# EAGLE schematic pcb_serial-adapter_serial-adapter (EAGLE 6.2)
DRAWING_NAME: CanSat 2012 Serial Adapter; REV: A
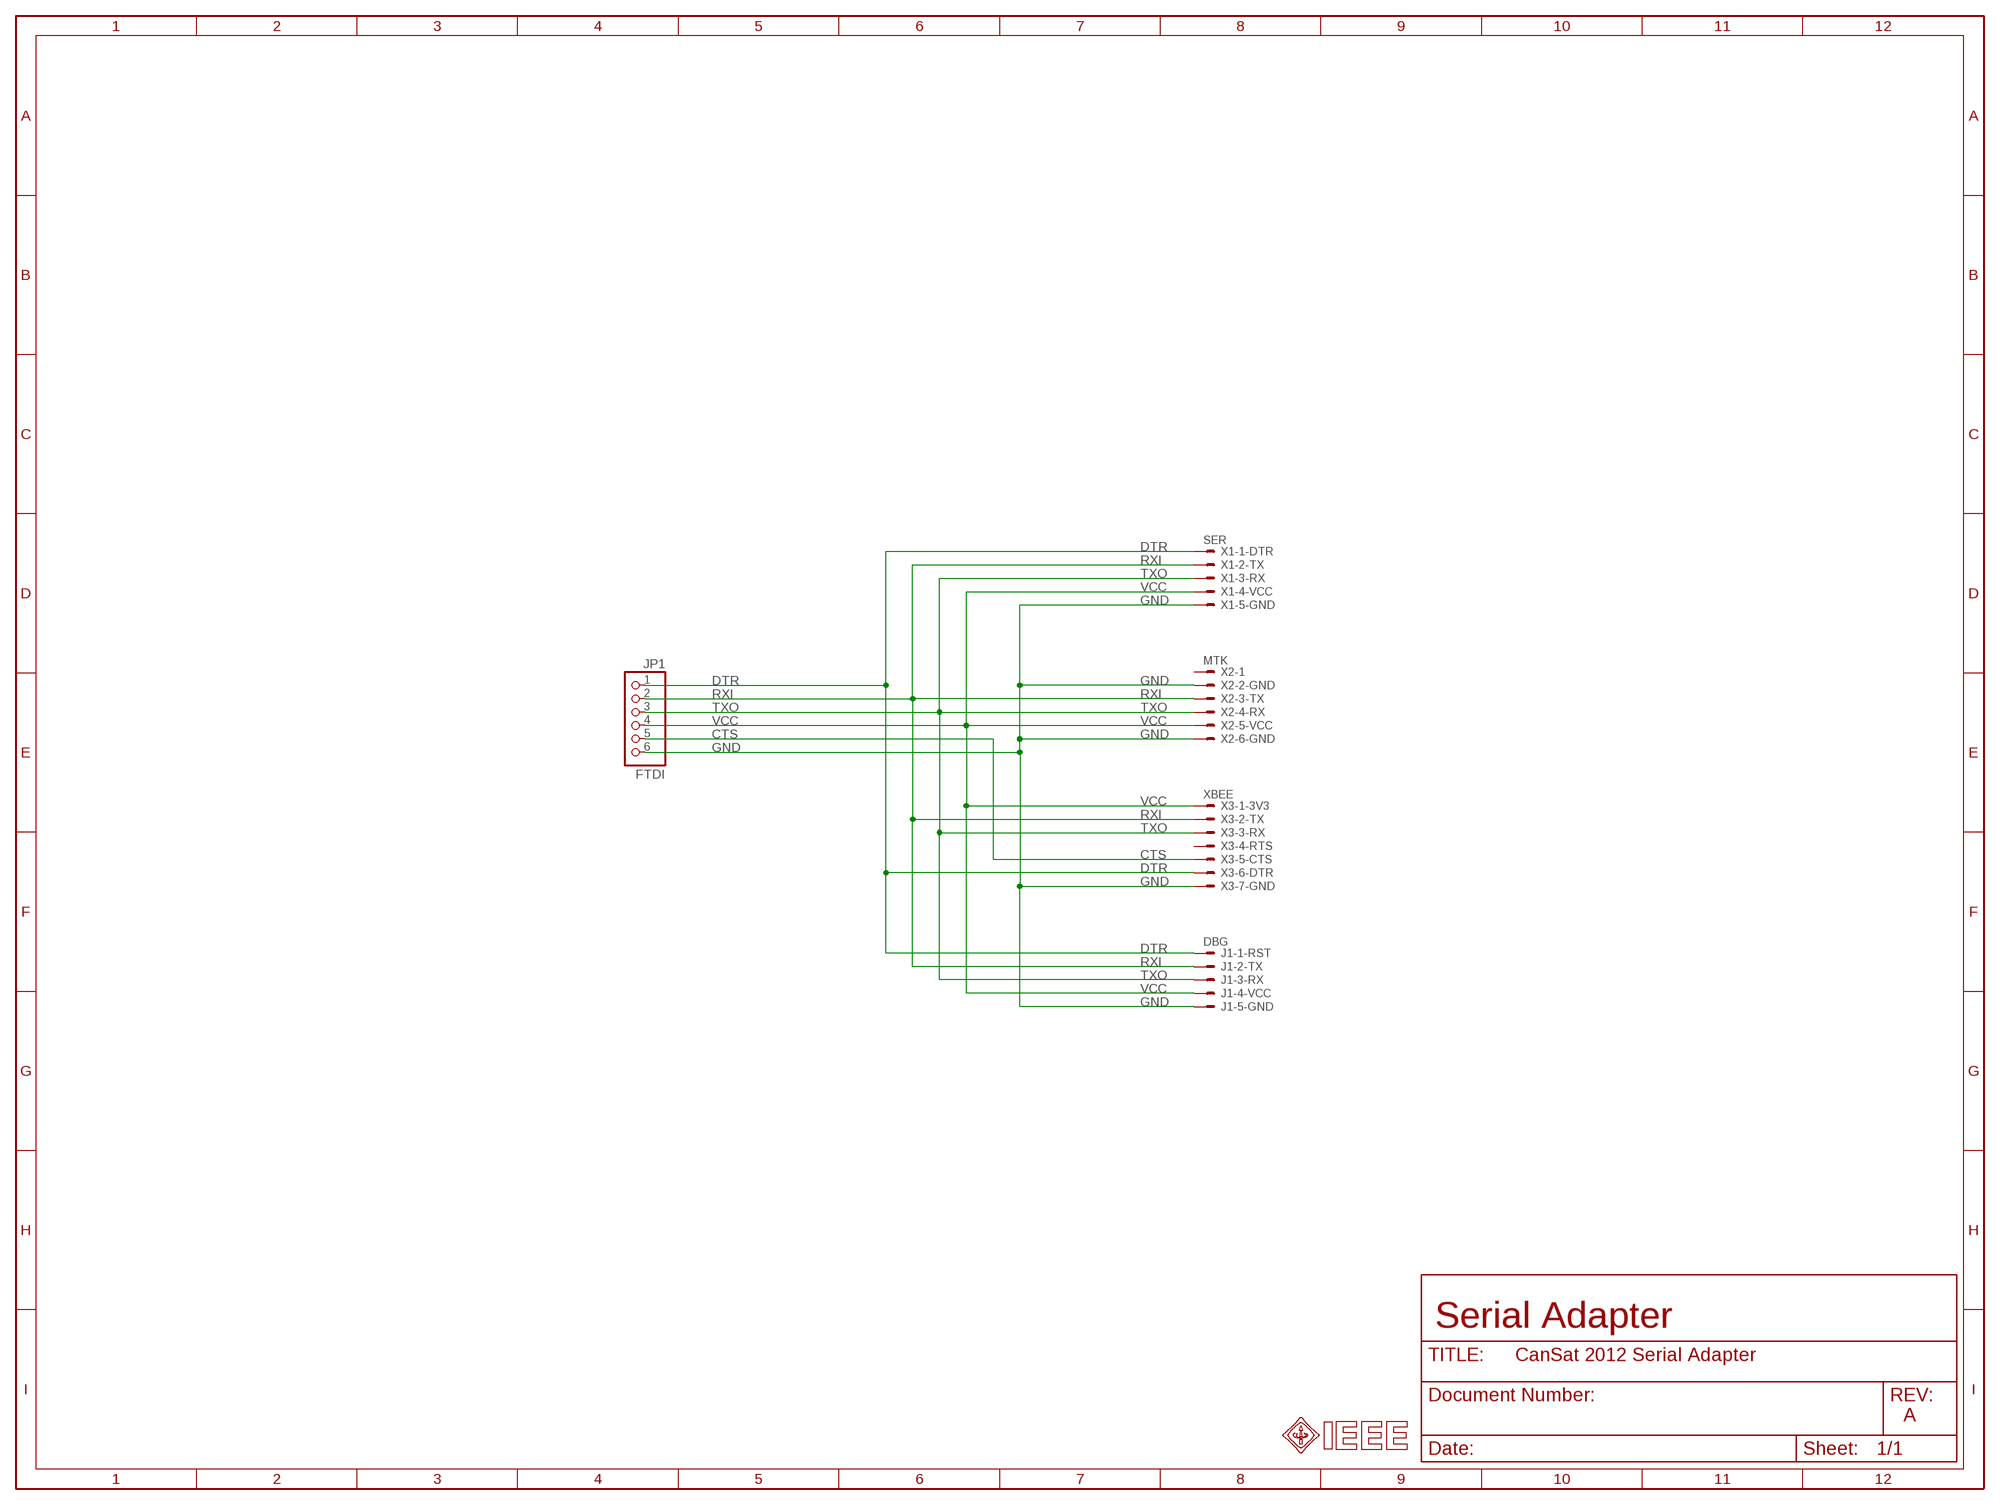
[diagram p0: schematic, sheet 1]

## Parts
J1  DBG  JST-PH-5-DBG-STB  [S5B-PH-SM4-TB]
JP1  FTDI  PINHD-1X6  [1X06]
X1  SER  SM05B-SRSS-TB-SER  [SM05B-SRSS-TB]
X2  MTK  SM06B-SRSS-TB-MTK  [SM06B-SRSS-TB]
X3  XBEE  SM07B-SRSS-TB-XBEE  [SM07B-SRSS-TB]

## Nets
CTS: JP1.5 X3.5
DTR: J1.1 JP1.1 X1.1 X3.6
GND: J1.5 JP1.6 X1.5 X2.2 X2.6 X3.7
RXI: J1.2 JP1.2 X1.2 X2.3 X3.2
TXO: J1.3 JP1.3 X1.3 X2.4 X3.3
VCC: J1.4 JP1.4 X1.4 X2.5 X3.1
Unconnected: X2.1 X3.4

## Notes on the sheet
- Serial Adapter

## Library data of the parts
J1 = interconnect:JST-PH-5-DBG
JP1 = pinhead:PINHD-1X6: PIN HEADER
X1 = interconnect:?M05B-SRSS-TB-SER: Disconnectable Crimp style connector, 1.0mm pitch 5 contacts
X2 = interconnect:?M06B-SRSS-TB-MTK: Disconnectable Crimp style connector, 1.0mm pitch 6 contacts
X3 = interconnect:?M07B-SRSS-TB-XBEE: Disconnectable Crimp style connector, 1.0mm pitch 7 contacts